# Altium schematic sheet POWER_DISTRIBUTION.SchDoc
size A4; SheetNumber: 6; SheetTotal: 7
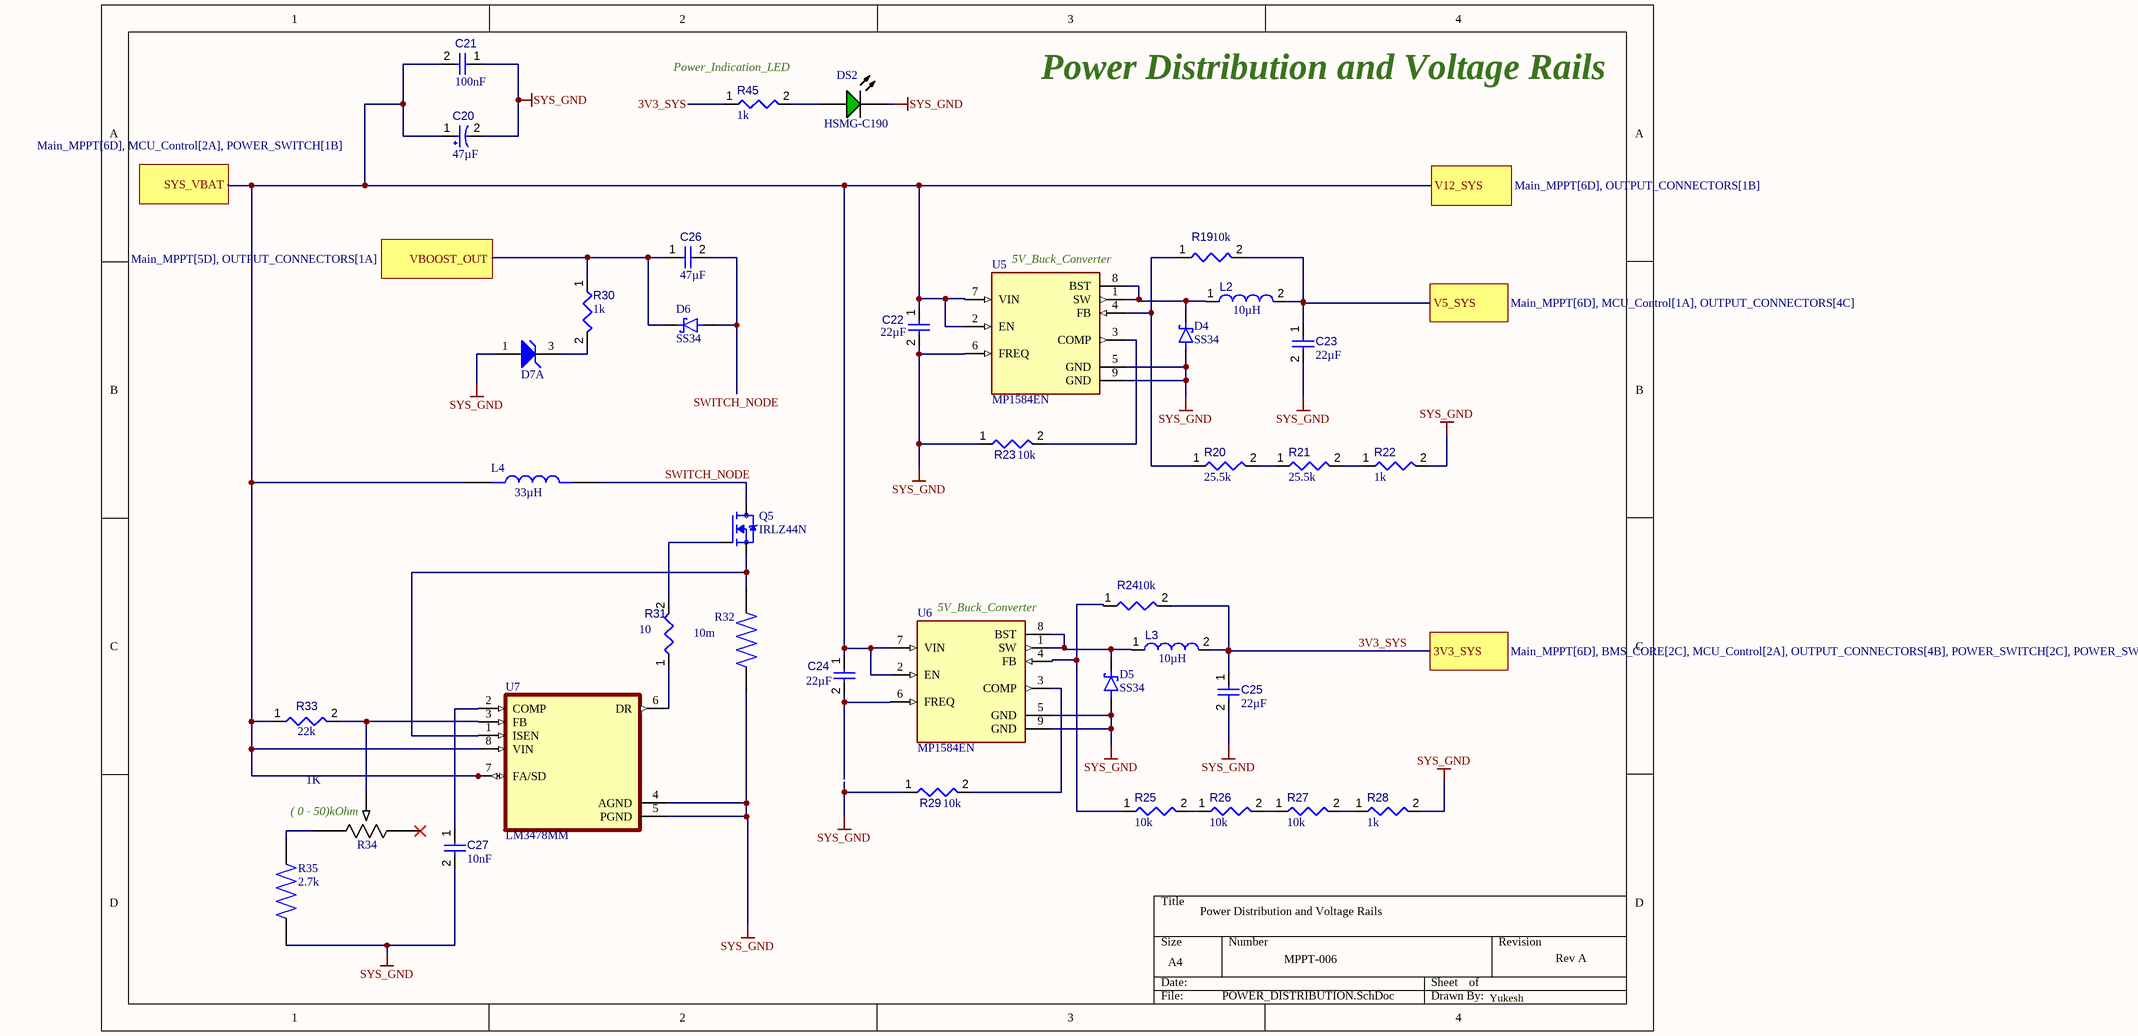
[diagram p0: POWER_DISTRIBUTION.SchDoc]

## Parts
C20  value 47µF  [CAPPR55-250-1120X630X1220]  (hidden comment: ECA1HM470)
C21  value 100nF  [CAPC0402(1005)60_L]  (hidden comment: Capacitor 100nF +/-20% 50V 0402)
C22  value 22µF  [CAPC0805(2012)145_L]  (hidden comment: Capacitor 22µF +/-40% 16V 0805)
C23  value 22µF  [CAPC0805(2012)145_L]  (hidden comment: Capacitor 22µF +/-40% 16V 0805)
C24  value 22µF  [CAPC0805(2012)145_L]  (hidden comment: Capacitor 22µF +/-40% 16V 0805)
C25  value 22µF  [CAPC0805(2012)145_L]  (hidden comment: Capacitor 22µF +/-40% 16V 0805)
C26  value 47µF  [CAPC0805(2012)145_L]  (hidden comment: Capacitor 47µF +/-40% 6.3V 0805)
C27  value 10nF  [CAPC0402(1005)60_L]  (hidden comment: Capacitor 10nF +/-20% 50V 0402)
D4  SS34  [Copy of DIOM7959X265N]
D5  SS34  [Copy of DIOM7959X265N]
D6  SS34  [Copy of DIOM7959X265N]
D7  BZX84C47LT1G  [ONSC-SOT-23-3-318-08_V]  (value not drawn)  (part A of 2)
DS2  HSMG-C190  [AVAG-HSMX-C190_V]
L2  value 10µH  [INDR62-500-1100X850X1100]  (hidden comment: RL622-100K-RC)
L3  value 10µH  [INDR62-500-1100X850X1100]  (hidden comment: RL622-100K-RC)
L4  value 33µH  [IND_ETQP4M330YFN]  (hidden comment: ETQP4M330YFN)
Q5  IRLZ44N  [TO254P1054X469X1930-3]
R19  value 10k  [RESC0402(1005)_L]  (hidden comment: Resistor 10K  +/-1 % 0402 63 mW)
R20  value 25.5k  [RESC0402(1005)_L]  (hidden comment: 25D5KR2F)
R21  value 25.5k  [RESC0402(1005)_L]  (hidden comment: 25D5KR2F)
R22  value 1k  [RESC0402(1005)_L]  (hidden comment: 1KR2J)
R23  value 10k  [RESC0402(1005)_L]  (hidden comment: Resistor 10K  +/-1 % 0402 63 mW)
R24  value 10k  [RESC0402(1005)_L]  (hidden comment: Resistor 10K  +/-1 % 0402 63 mW)
R25  value 10k  [RESC0402(1005)_L]  (hidden comment: 10KR2F)
R26  value 10k  [RESC0402(1005)_L]  (hidden comment: 10KR2F)
R27  value 10k  [RESC0402(1005)_L]  (hidden comment: 10KR2F)
R28  value 1k  [RESC0402(1005)_L]  (hidden comment: 1KR2J)
R29  value 10k  [RESC0402(1005)_L]  (hidden comment: Resistor 10K  +/-1 % 0402 63 mW)
R30  value 1k  [RESC0805(2012)_L]  (hidden comment: 1KR5J)
R31  value 10  [RESC0402(1005)_L]  (hidden comment: 10R2F)
R32  value 10m  [RESC6331X88N]  (hidden comment: WSL2512R0100FEA18)
R33  value 22k  [RESC0402(1005)_L]  (hidden comment: 22KR2F)
R34  value 1K  [POT3_T63XB]  (hidden comment: T63XB503KT20)
R35  value 2.7k  [RES_ERJ2RHD2702X]  (hidden comment: ERJ2RHD2702X)
R45  value 1k  [RESC0402(1005)_L]  (hidden comment: 1KR2J)
U5  MP1584EN  [SOIC127P600X170-9N]
U6  MP1584EN  [SOIC127P600X170-9N]
U7  LM3478MM  [SOP65P490X110-8N]

## Ports
3V3_SYS (see Main_MPPT[6D], BMS_CORE[2C], MCU_Control[2A], OUTPUT_CONNECTORS[4B], POWER_SWITCH[2C], POWER_SWITCH[2D], USB_DEBUG[4B]), SYS_VBAT (see Main_MPPT[6D], MCU_Control[2A], POWER_SWITCH[1B]), V5_SYS (see Main_MPPT[6D], MCU_Control[1A], OUTPUT_CONNECTORS[4C]), V12_SYS (see Main_MPPT[6D], OUTPUT_CONNECTORS[1B]), VBOOST_OUT (see Main_MPPT[5D], OUTPUT_CONNECTORS[1A])

## Nets
SYS_GND: C20.2 C21.1 C22.2 C23.2 C25.2 C27.2 D4.A D5.A D7.1(A) DS2.2(K) R22.2 R23.1 R28.2 R29.1 R32.1 R35.2 U5.5(GND) U5.6(FREQ) U5.9(GND) U6.5(GND) U6.9(GND) U7.4(AGND) U7.5(PGND)
3V3_SYS: C25.1 L3.2 R24.2 R45.1 ; port 3V3_SYS
SWITCH_NODE: C26.2 D6.A L4.2 Q5.2(D)
SYS_VBAT: C20.1 C21.2 C22.1 C24.1 L4.1 R33.1 U5.2(EN) U5.7(VIN) U6.2(EN) U6.7(VIN) U7.7(FA/SD) U7.8(VIN) ; port SYS_VBAT, port V12_SYS
V5_SYS: C23.1 L2.2 R19.2 ; port V5_SYS
VBOOST_OUT: C26.1 D6.C(K) R30.1 ; port VBOOST_OUT
NetC24_2: C24.2 U6.6(FREQ)
NetC27_1: C27.1 U7.2(COMP)
NetD4_C: D4.C(K) L2.1 U5.1(SW) U5.8(BST)
NetD5_C: D5.C(K) L3.1 U6.1(SW) U6.8(BST)
NetD7_3: D7.3(K) R30.2
NetDS2_1: DS2.1(A) R45.2
NetQ5_1: Q5.1(G) R31.2
NetQ5_3: Q5.3(S) R32.2 U7.1(ISEN)
NetR19_1: R19.1 R20.1 U5.4(FB)
NetR20_2: R20.2 R21.1
NetR21_2: R21.2 R22.1
NetR23_2: R23.2 U5.3(COMP)
NetR24_1: R24.1 R25.1 U6.4(FB)
NetR25_2: R25.2 R26.1
NetR26_2: R26.2 R27.1
NetR27_2: R27.2 R28.1
NetR29_2: R29.2 U6.3(COMP)
NetR31_1: R31.1 U7.6(DR)
NetR33_2: R33.2 R34.2 U7.3(FB)
NetR34_1: R34.1 R35.1

Not connected (* = marked no-connect by the designer): R34 3*

## Notes on the sheet
- (near R45) Power_Indication_LED
- Power Distribution and Voltage Rails
- (near U5) 5V_Buck_Converter
- (near U6) 5V_Buck_Converter
- (near R34) ( 0 - 50)kOhm
- MPPT-006
- Rev A
- Yukesh

## Library data of the parts
C20 = CMP-001-00030-7: Aluminum Electrolytic Capacitor, 47 uF, +/- 20%, 50 V, -40 to 85 degC, 2-Pin THD, RoHS, Bulk; Manufacturer: Panasonic; Voltage Rating: 50V; Ripple Current: 130mA; Package Reference: CAPPR55-250-1120X630X1220; Packaging: Bulk; Case/Package: Radial; Pins: 2; Package Description: 2-Pin Radial Lead, Dia 6.3 mm, Height 12.2 mm; Capacitor Type: Electrolytic; Max Operating Temperature: 85°C; Min Operating Temperature: -40°C; Datasheet Version: Rev. 05, 10/2016; Manufacturer URL: http://www.panasonic.com/; RoHS Compliant: True; Lead Pitch: 2.5mm; Package Quantity: 200; Mounting Technology: TH; Ripple Current (AC): 130mA; Datasheet URL: https://industrial.panasonic.com/cdbs/www-data/pdf/RDF0000/ABA0000C1218.pdf; Tolerance: 20%; Diameter: 6.3mm
C21 = CMP-001-00067-3: Chip Capacitor, 100nF +/-20%, 50V, 0402, Thickness 0.6 mm; Tolerance: 10%; Min Operating Temperature: -55°C; Pins: 2; Case/Package: 0402; Max Operating Temperature: 85°C; Voltage Rating: 50V; Mounting Technology: SMT
C22-C25 = CMP-001-00081-4: Chip Capacitor, 22µF +/-40%, 16V, 0805, Thickness 1.45 mm; Tolerance: 5%; Voltage Rating: 16V; Mounting Technology: SMT; Pins: 2; Max Operating Temperature: 85°C; Case/Package: 0805; Min Operating Temperature: -55°C
C26 = CMP-001-00082-4: Chip Capacitor, 47µF +/-40%, 6.3V, 0805, Thickness 1.45 mm; Tolerance: 10%; Min Operating Temperature: -55°C; Max Operating Temperature: 85°C; Case/Package: 0805; Pins: 2; Mounting Technology: SMT; Voltage Rating: 6.3V
C27 = CMP-001-00069-3: Chip Capacitor, 10nF +/-20%, 50V, 0402, Thickness 0.6 mm; Tolerance: 5%; Max Operating Temperature: 85°C; Pins: 2; Case/Package: 0402; Voltage Rating: 50V; Min Operating Temperature: -55°C; Mounting Technology: SMT
D4-D6 = CMP-004-00071-2: Diode Schottky 40 V 3A Surface Mount SMC (DO-214AB); Value: IC; MF: onsemi; Source: SS34.SchLib; SnapEDA_Link: https://www.snapeda.com/parts/SS34/Onsemi/view-part/?ref=snap; Case/Package: SMC-2 ON Semiconductor; Component Type: Standard; MP: SS34; Pins: 2; Design Item ID: SS34; Check_prices: https://www.snapeda.com/parts/SS34/Onsemi/view-part/?ref=eda
D7 = CMP-1060-01145-1: Zener Voltage Regulator, 225 mW, 3-Pin SOT-23, Pb-Free, Tape and Reel; Manufacturer: On Semiconductor; ComponentLink2Description: Datasheet; PackageReference: SOT-23-3-318-08; PackageVersion: Rev. AP, 11/2009; ComponentLink3Description: Package Specification; PackageDescription: 3-Pin Small Outline Transistor, Body 2.92 x 1.3 mm, Pitch 0.95 mm; DatasheetVersion: Rev. 17; Mounting Technology: Surface Mount; ComponentLink1Description: Manufacturer URL; Packing: Tape and Reel; ComponentLink3URL: http://www.onsemi.cn/pub_link/Collateral/318-08.PDF; ComponentLink2URL: http://www.onsemi.com/pub_link/Collateral/BZX84C2V4LT1-D.PDF; RoHS: Pb-Free; ComponentLink1URL: http://www.onsemi.com/; PartNumber: BZX84C47LT1G
DS2 = CMP-007-00013-2: LED Uni-Color Green, 52 mW, 20 mA, -40 to 85 degC, 2-Pin SMD, RoHS, Tape and Reel; Manufacturer: Avago; Forward Current: 20mA; Viewing Angle: 170degrees; Luminous Intensity: 15mcd; Lens Style: Diffused; Forward Voltage: 2.2V; Power: 52mW; Mounting Technology: SM; RoHS Compliant: True; Packaging: TapeandReel; Illumination Colour: Green; Datasheet URL: http://docs.avagotech.com/docs/AV02-0551EN; Min Operating Temperature: -40°C; Max Operating Temperature: 85°C; Pins: 2; Package Description: 2-Pin Surface Mount Device, Body 1.6 x 0.8 mm, Height 0.9 mm; Nominal Vf: 2.2V; Case/Package: 0603; Manufacturer URL: http://www.avagotech.com/; Datasheet Version: Mar-12; Colour: Green; Package Reference: HSMX-C190; Package Quantity: 4000
L2 L3 = CMP-006-00012-6: Radial Inductor, 10 uH, +/- 10%, 3 A, -55 to 105 degC, 2-Pin THD, RoHS, Bulk; Manufacturer: Bourns; Resistance: 0.045Ohm; Core Material: Ferrite; Current Rating: 3A; Shielding: Unshielded; Self Resonant Frequency: 14MHz; Q Factor: 50; Lead Pitch: 5mm; Min Operating Temperature: -55°C; Datasheet URL: http://www.bourns.com/docs/Product-Datasheets/rl622_series.pdf; Datasheet Version: Aug-10; Package Reference: INDR62-500-1100X850X1100; Package Description: 2-Pin Radial Lead, Dia 8.5 mm, Pitch 5 mm; Package Quantity: 100; Packaging: Bulk; Mounting Technology: TH; Case/Package: Radial; Pins: 2; Inductance Tolerance: 10%; Tolerance: 10%; Diameter: 8.5mm; Max Operating Temperature: 105°C; RoHS Compliant: True
L4 = CMP-006-00029-2: FIXED IND 33UH 2.5A 189.2MOHM SM; MF: Panasonic; Purchase-URL: https://pricing.snapeda.com/search/part/ETQP4M330YFN/?ref=eda; Component Type: Standard; Source: ETQP4M330YFN.SchLib; Pins: 2; SnapEDA_Link: https://www.snapeda.com/parts/ETQP4M330YFN/Panasonic/view-part/?ref=snap; Check_prices: https://www.snapeda.com/parts/ETQP4M330YFN/Panasonic/view-part/?ref=eda; MP: ETQP4M330YFN; Design Item ID: ETQP4M330YFN; Availability: In Stock; Case/Package: SMD-2 Panasonic; Price: None
Q5 = CMP-048-000000-1: N-Channel 55 V 47A (Tc) 3.8W (Ta), 110W (Tc) Surface Mount D2PAK; Value: IC; MF: Infineon / IR; Availability: Not in stock; Price: None; Package: TO-220-3 Infineon / IR; Check_prices: https://www.snapeda.com/parts/IRLZ44N/Infineon/view-part/?ref=eda; Design Item ID: IRLZ44N; Pin Count: 3; Component Type: Standard; Source: IRLZ44N.SchLib; MP: IRLZ44N; SnapEDA_Link: https://www.snapeda.com/parts/IRLZ44N/Infineon/view-part/?ref=snap
R19 R23 R24 R29 = CMP-009-00149-3: Chip Resistor, 10 kOhms, +/-1 %, 63 mW, -55 to 125 degC, 0402; Power: 63mW; Tolerance: 1%; Min Operating Temperature: -55°C; Case/Package: 0402; Max Operating Temperature: 155°C; Pins: 2
R20 R21 = CMP-009-00085-2: 25K5 0.063W 1% 0402 (1005 Metric)  SMD; Power: 63mW; Tolerance: 1%; Pins: 2; Mounting Technology: SMT; Case/Package: 0402
R22 R28 R45 = CMP-009-00075-2: 1K 0.063W 5% 0402 (1005 Metric)  SMD; Power: 63mW; Pins: 2; Mounting Technology: SMT; Case/Package: 0402; Tolerance: 5%
R25-R27 = CMP-009-00066-2: 10K 0.063W 1% 0402 (1005 Metric)  SMD; Power: 63mW; Case/Package: 0402; Mounting Technology: SMT; Pins: 2; Tolerance: 1%
R30 = CMP-009-00076-2: 1K 0.125W 5% 0805 (2012 Metric)  SMD; Power: 125mW; Pins: 2; Mounting Technology: SMT; Tolerance: 5%; Case/Package: 0805
R31 = CMP-009-00067-2: 10R 0.063W 1% 0402 (1005 Metric)  SMD; Power: 63mW; Case/Package: 0402; Tolerance: 1%; Mounting Technology: SMT; Pins: 2
R32 = CMP-009-00189-1: METAL STRIP RESISTOR, 0.01OHM, 1%, 2512; Resistance: 0.01ohm; Product Range: WSL High Power Series; Resistor Case / Package: 2512 ^6432 Metric]; Power Rating: 2W; Resistance Tolerance: ± 1%; Resistor Techn 18X4752; MF: Vishay Intertechnology; Check_prices: https://www.snapeda.com/parts/WSL2512R0100FEA18/Vishay/view-part/?ref=eda; SnapEDA_Link: https://www.snapeda.com/parts/WSL2512R0100FEA18/Vishay/view-part/?ref=snap; MP: WSL2512R0100FEA18; Pins: 2; Source: WSL2512R0100FEA18.SchLib; Case/Package: SMD Vishay; Design Item ID: WSL2512R0100FEA18; Component Type: Standard
R33 = CMP-009-00081-2: 22K 0.063W 1% 0402 (1005 Metric)  SMD; Power: 63mW; Tolerance: 1%; Pins: 2; Mounting Technology: SMT; Case/Package: 0402
R34 = CMP-009-00177-2: T63 XB 50K 10% TU e3; Manufacturer_Name: Vishay; Copyright: Copyright (C) 2026 Ultra Librarian. All rights reserved.; Source: T63XB503KT20.SchLib; Datasheet: https://www.vishay.com/doc?51024; Manufacturer_Part_Number: T63XB503KT20; Design Item ID: T63XB503KT20
R35 = CMP-009-00188-1: ERJ2R Resistor 0.063W 27K 0.5% 50ppm; MF: Panasonic; Pins: 2; Case/Package: 1020-2 Panasonic; Design Item ID: ERJ2RHD2702X; SnapEDA_Link: https://www.snapeda.com/parts/ERJ2RHD2702X/Panasonic/view-part/?ref=snap; Component Type: Standard; Source: ERJ2RHD2702X.SchLib; MP: ERJ2RHD2702X; Check_prices: https://www.snapeda.com/parts/ERJ2RHD2702X/Panasonic/view-part/?ref=eda
U5 U6 = CMP-031-06209-1: Buck Switching Regulator IC Positive Adjustable 0.8V 1 Output 3A 8-SOIC (0.154, 3.90mm Width) Exposed Pad; MF: Monolithic Power; Source: MP1584EN.SchLib; Value: IC; Check_prices: https://www.snapeda.com/parts/MP1584EN/Monolithic+Power+Systems/view-part/?ref=eda; Design Item ID: MP1584EN; MP: MP1584EN; Component Type: Standard; SnapEDA_Link: https://www.snapeda.com/parts/MP1584EN/Monolithic+Power+Systems/view-part/?ref=snap; Case/Package: SOIC-8 Monolithic Power; Pins: 9
U7 = CMP-054-000000-1: 2.97~40V Wide Input Range Boost/SEPIC/Flyback DC-DC Controller; Value: IC; MP: LM3478MM/NOPB; MF: Texas Instruments; Check_prices: https://www.snapeda.com/parts/LM3478MM/NOPB/Texas+Instruments/view-part/?ref=eda; Source: LM3478MM.SchLib; SnapEDA_Link: https://www.snapeda.com/parts/LM3478MM/NOPB/Texas+Instruments/view-part/?ref=snap; Component Type: Standard; Pin Count: 8; Package: VSSOP-8 Texas Instruments; Design Item ID: LM3478MM